# EAGLE design B7D_1_1 (EAGLE 8.3.2)
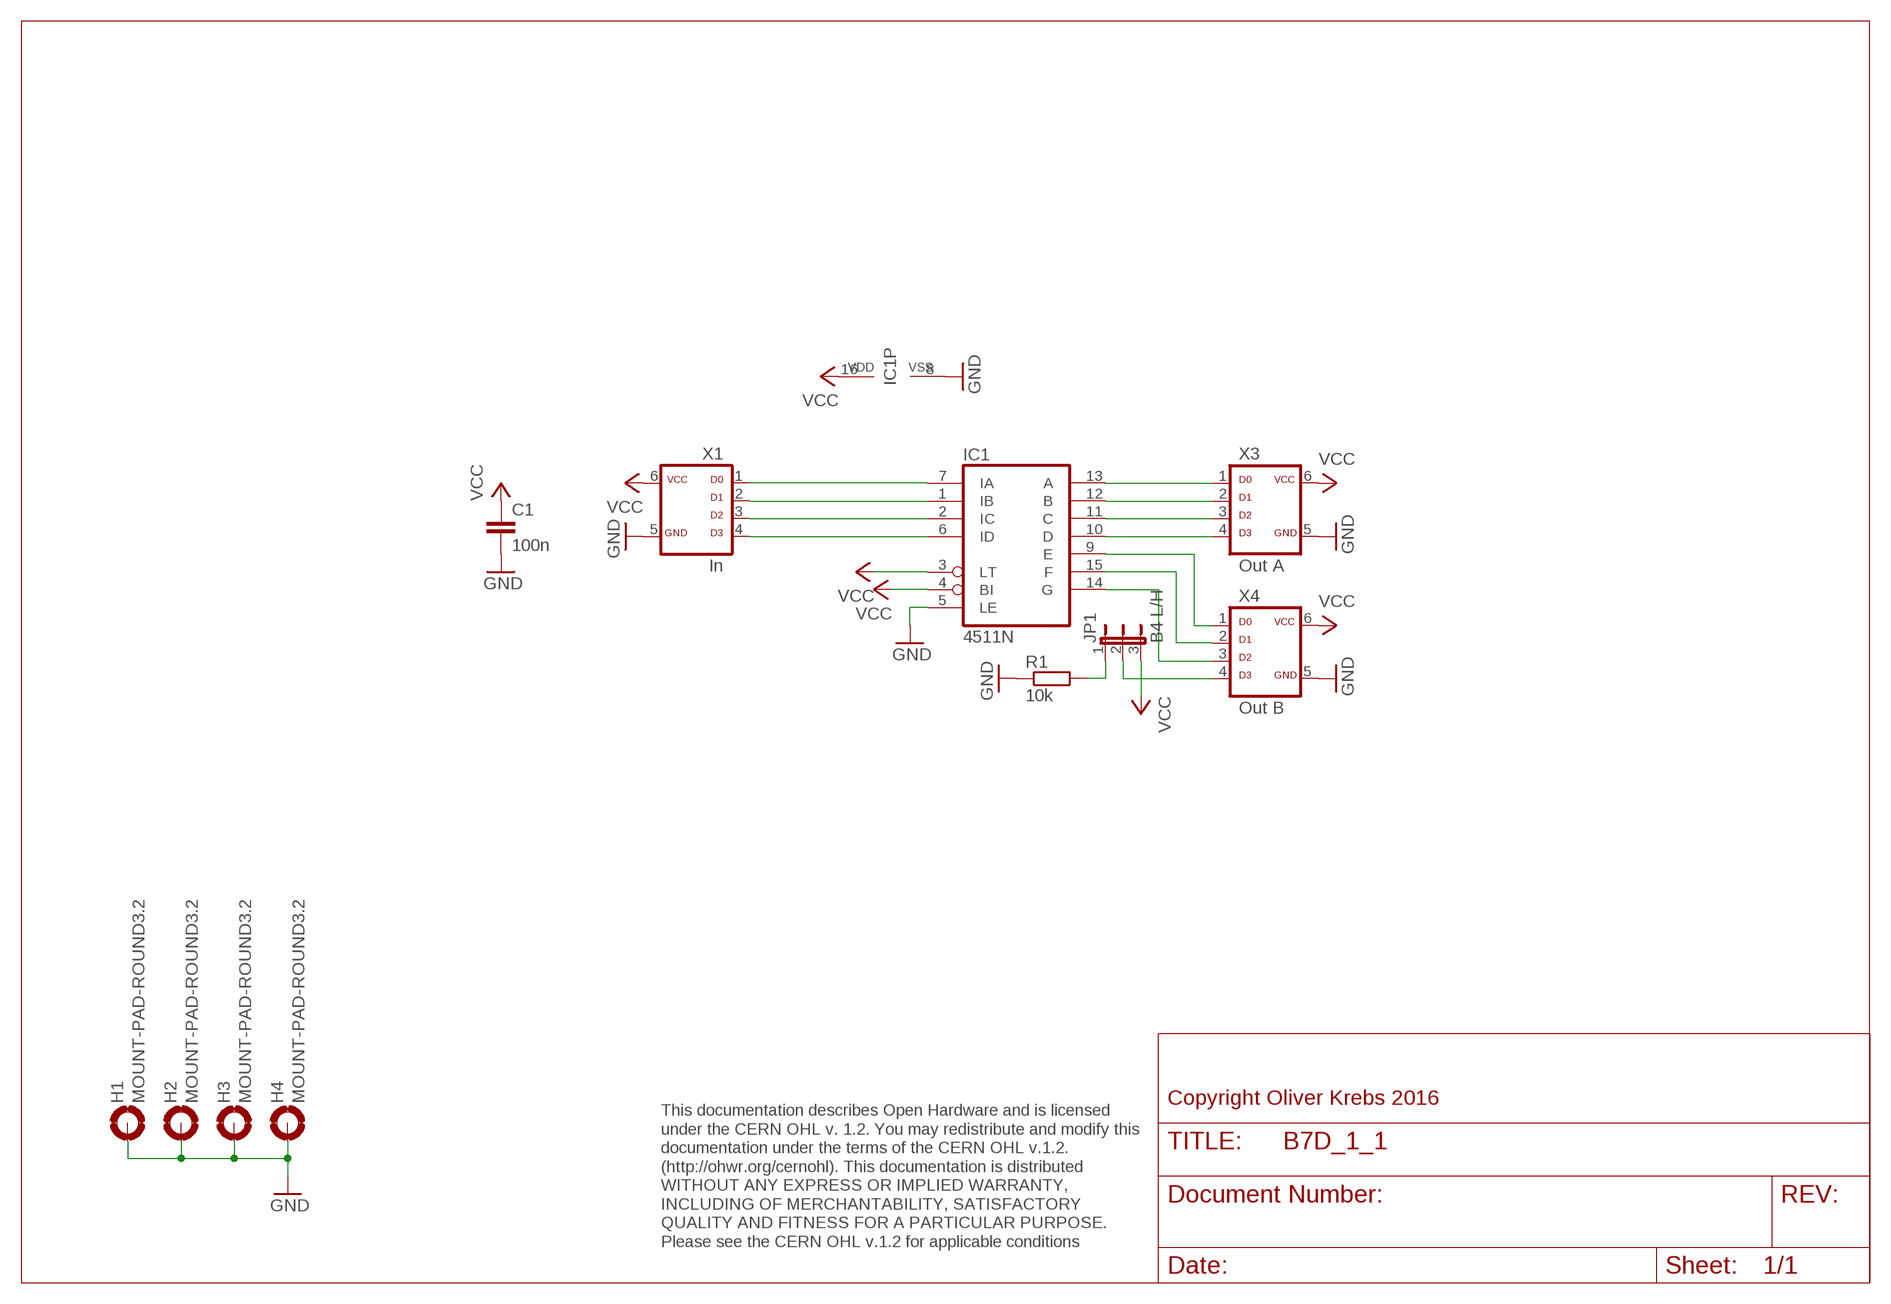
[diagram p0: schematic, sheet 1]

## Parts
C1  100n  C-EU050-025X075  [C050-025X075]
H1  MOUNT-PAD-ROUND3.2  [3,2-PAD]
H2  MOUNT-PAD-ROUND3.2  [3,2-PAD]
H3  MOUNT-PAD-ROUND3.2  [3,2-PAD]
H4  MOUNT-PAD-ROUND3.2  [3,2-PAD]
IC1  4511N  [DIL16]
JP1  B4 L/H  JP2E  [JP2]
R1  10k  R-EU_0207/10  [0207/10]
X1  In  ML6D  [ML-6]
X3  Out A  ML6D  [ML-6]
X4  Out B  ML6D  [ML-6]

## Nets
GND: C1.2 H1.B3,2(MOUNT) H2.B3,2(MOUNT) H3.B3,2(MOUNT) H4.B3,2(MOUNT) IC1.5(LE) IC1.8(VSS) R1.1 X1.5 X3.5 X4.5
N$1: IC1.7(IA) X1.1
N$2: IC1.1(IB) X1.2
N$3: IC1.2(IC) X1.3
N$4: IC1.6(ID) X1.4
N$5: IC1.13(A) X3.1
N$6: IC1.12(B) X3.2
N$7: IC1.11(C) X3.3
N$8: IC1.10(D) X3.4
N$9: IC1.9(E) X4.1
N$10: IC1.15(F) X4.2
N$11: IC1.14(G) X4.3
N$13: JP1.2 X4.4
N$14: JP1.1 R1.2
VCC: C1.1 IC1.3(LT) IC1.4(BI) IC1.16(VDD) JP1.3 X1.6 X3.6 X4.6

## Notes on the sheet
- Copyright Oliver Krebs 2016
- This documentation describes Open Hardware and is licensed 
  under the CERN OHL v. 1.2. You may redistribute and modify this 
  documentation under the terms of the CERN OHL v.1.2. 
  (http://ohwr.org/cernohl). This documentation is distributed
  WITHOUT ANY EXPRESS OR IMPLIED WARRANTY, 
  INCLUDING OF MERCHANTABILITY, SATISFACTORY 
  QUALITY AND FITNESS FOR A PARTICULAR PURPOSE. 
  Please see the CERN OHL v.1.2 for applicable conditions

## Library data of the parts
C1 = 01-my_rcl:C-EU: CAPACITOR, European symbol
H1-H4 = holes:MOUNT-PAD-ROUND: MOUNTING PAD, round
IC1 = 45xx:4511: BCD to 7-segment LATCH/DECODER/DRIVER
JP1 = jumper:JP2E: JUMPER
R1 = 01-my_rcl:R-EU_: RESISTOR, European symbol
X1 X3 X4 = 01-my-con:ML6D

## Board
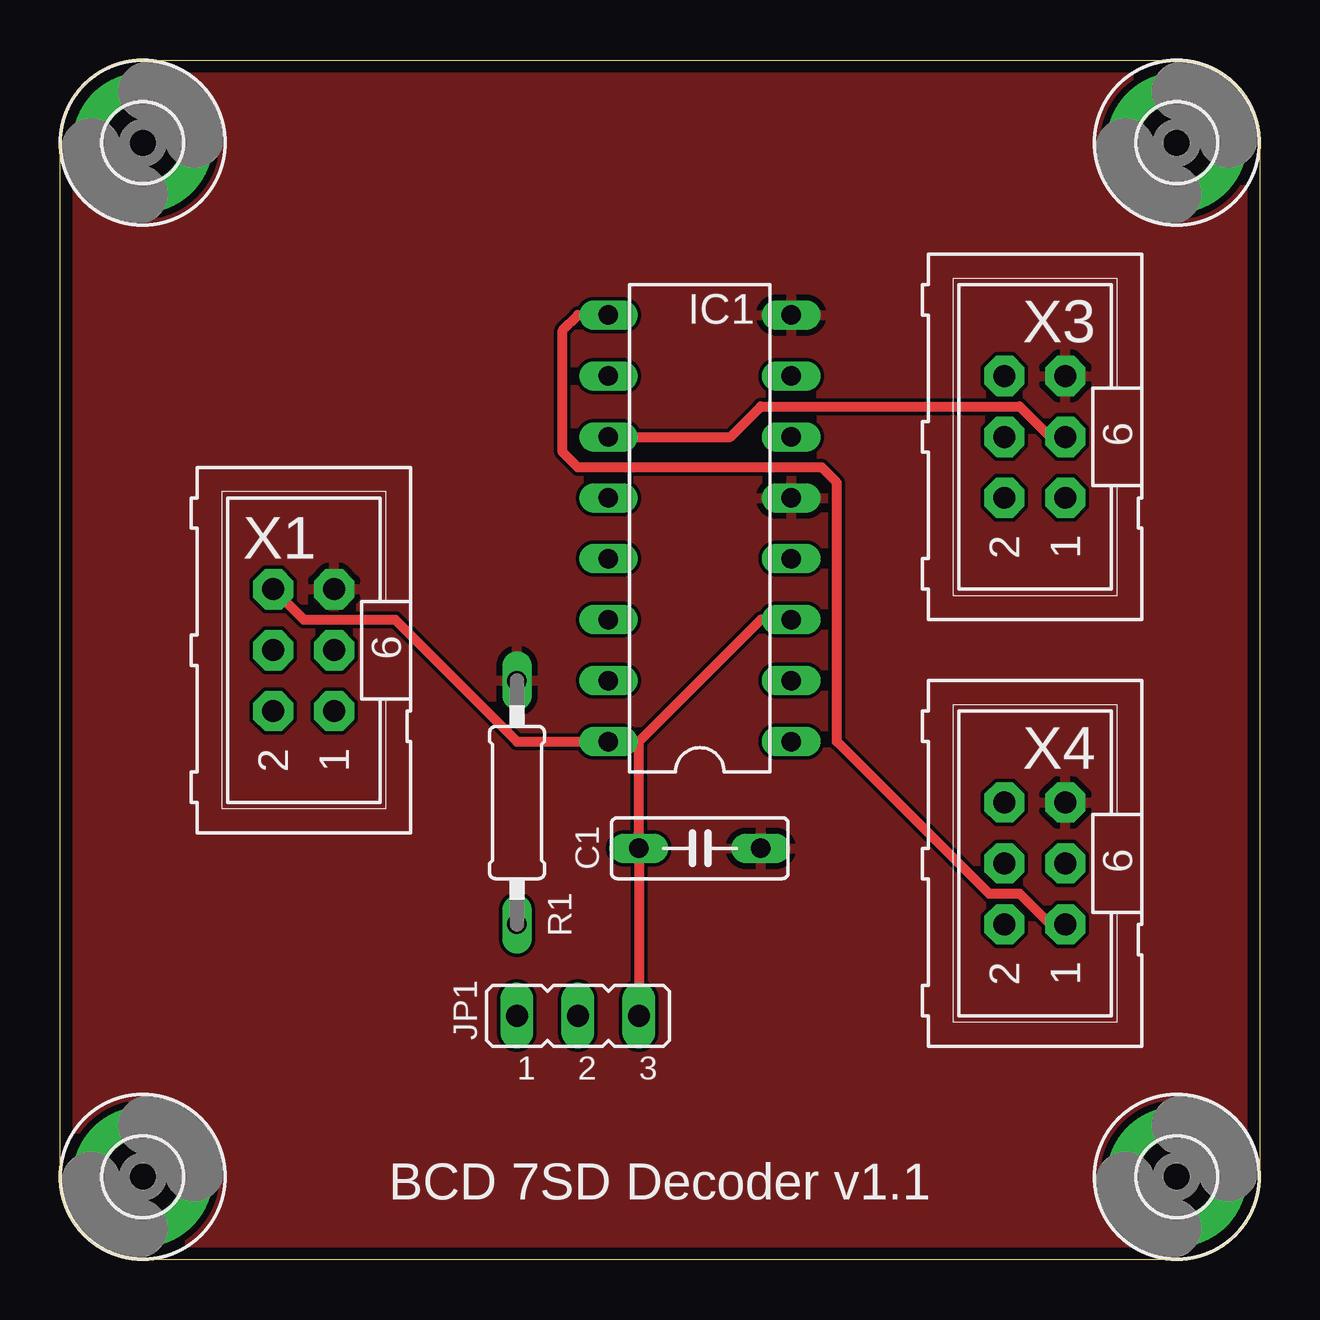
[diagram p1: board, top side]
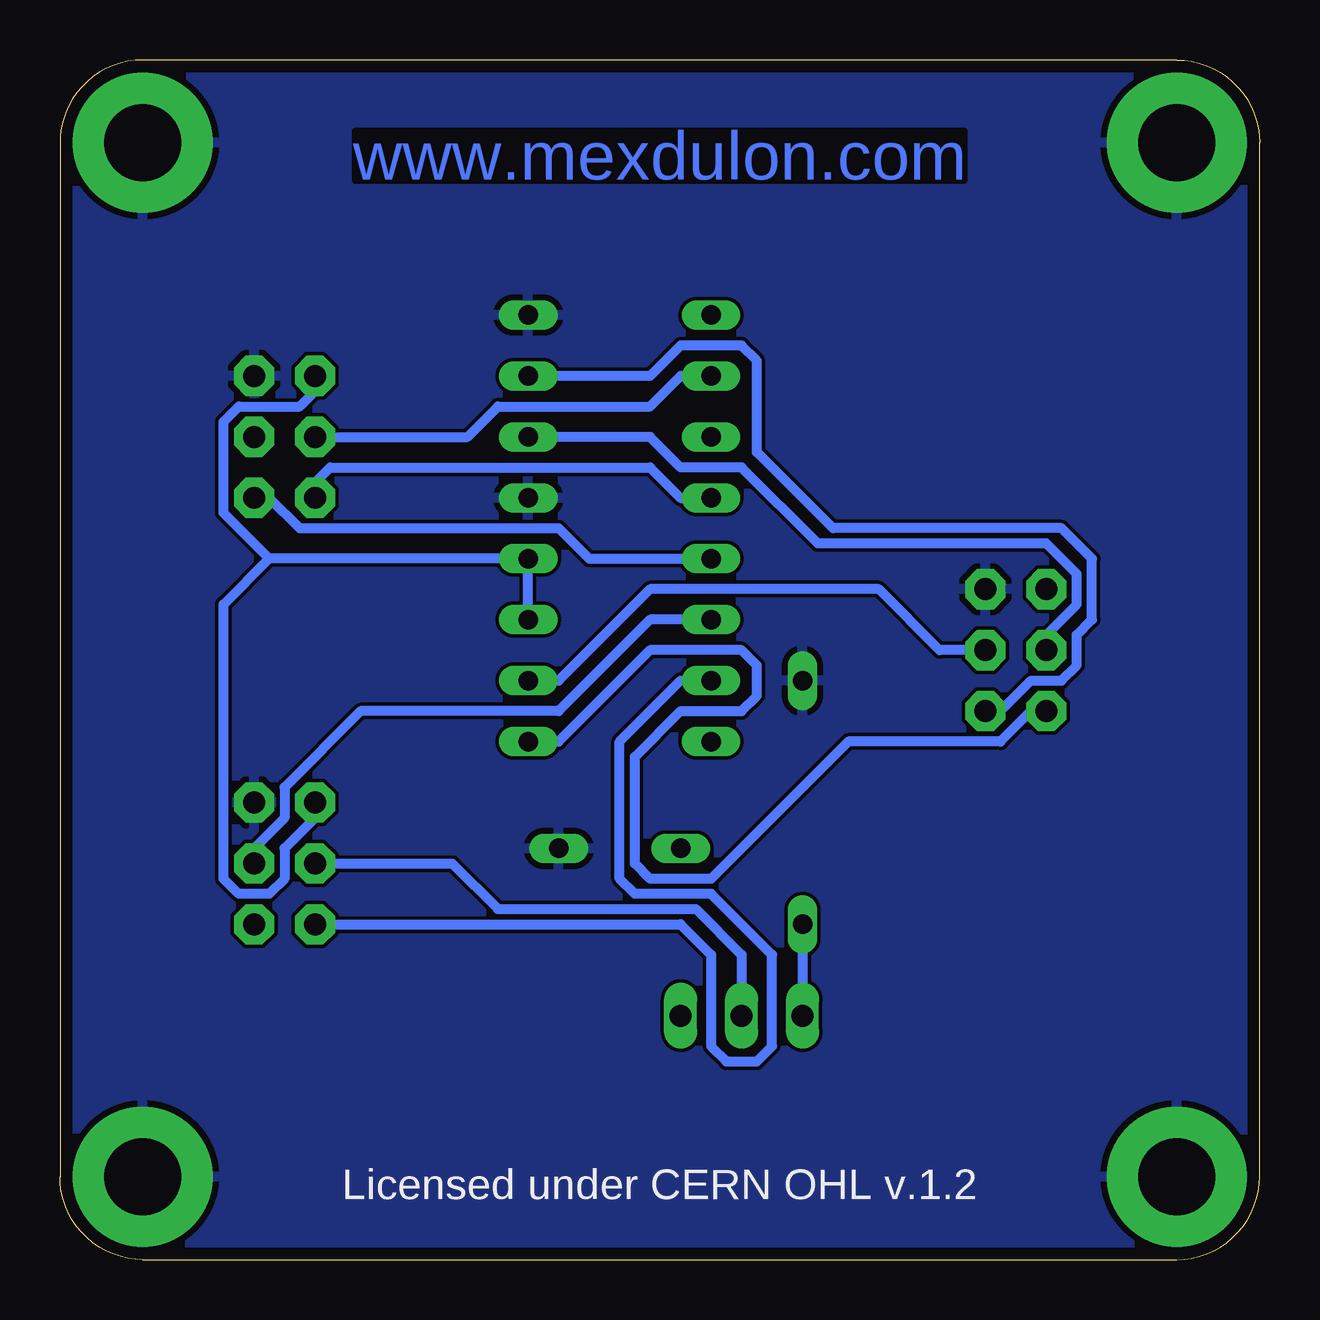
[diagram p2: board, bottom side, seen from below]

Size 50 x 50 mm. Coordinates in mm from the lower left corner, seen from the top.
Outline: 0,3.45 0,46.55 arc-90 3.45,50 46.55,50 arc-90 50,46.55 50,3.45 arc-90 46.55,0 3.45,0 arc-90 0,3.45
Copper layers (1*16): Top 0.035mm / dielectric 1.6mm / Bottom 0.035mm
Design rules "Elecrow_2-layer_PCB_eagle_rule": minimum track width 6mil, minimum drill 12mil, track to track 6mil, track to pad 6mil, pad to pad 6mil, via to via 8mil, smd to smd 0mil, copper to edge 20mil, drill to drill 10mil, minimum pad ring 6mil, minimum via ring 6mil, stop-mask expansion 0mil, vias tented up to drill 100mil, thermal gap 10mil

### Footprints (pad centres in the part's own frame; a part is rotated, then mirrored left to right if it is on the bottom)
C050-025X075 = drill 0.813 long: 1 -2.54,0; 2 2.54,0
3,2-PAD = drill 3.2 pad 5.842: B3,2 0,0
DIL16 = drill 0.813 long: 1 -8.89,-3.81; 2 -6.35,-3.81; 3 -3.81,-3.81; 4 -1.27,-3.81; 5 1.27,-3.81; 6 3.81,-3.81; 7 6.35,-3.81; 8 8.89,-3.81; 9 8.89,3.81; 10 6.35,3.81; 11 3.81,3.81; 12 1.27,3.81; 13 -1.27,3.81; 14 -3.81,3.81; 15 -6.35,3.81; 16 -8.89,3.81
JP2 = drill 0.914 long: 1 -2.54,0; 2 0,0; 3 2.54,0
0207/10 = drill 0.813 long: 1 -5.08,0; 2 5.08,0
ML-6 = drill 0.914 pad 1.676 octagon: 1 -2.54,-1.27; 2 -2.54,1.27; 3 0,-1.27; 4 0,1.27; 5 2.54,-1.27; 6 2.54,1.27

### Placement (x,y rotation side)
C1  26.67,17.14 0 top
H1  3.45,3.45 0 top
H2  3.45,46.55 0 top
H3  46.55,46.55 0 top
H4  46.55,3.45 0 top
IC1  26.67,30.48 90 top
JP1  21.59,10.16 0 top
R1  19.05,19.05 270 top
X1  10.16,25.4 90 top
X3  40.64,34.29 90 top
X4  40.64,16.51 90 top

### Tracks (layer width: path | path; a pad name or v marks a point on that pad's centre or on a via)
GND
  pour Bottom: 0,0 50.8,0 50.8,50.8 0,50.8
  pour Top: 0,50.16 50.16,50.16 50.16,0 0,0
N$1
  Bottom 0.406: X1.1 10.79,22.86 9.53,24.13 8.26,24.13 7.62,24.77 7.62,26.04 6.99,26.67 6.99,29.21 8.26,30.48 17.78,30.48 20.95,33.66 20.95,37.47 21.59,38.1 24.13,38.1 25.4,36.83 IC1.7
N$2
  Bottom 0.406: X1.2 9.53,22.86 10.79,21.59 17.14,21.59 22.86,15.88 25.4,15.88 26.04,16.51 26.04,20.95 24.13,22.86 21.59,22.86 20.95,23.5 20.95,24.77 21.59,25.4 25.4,25.4 29.21,21.59 IC1.1
N$3
  Bottom 0.406: X1.3 13.34,25.4 15.88,27.94 25.4,27.94 29.21,24.13 IC1.2
N$4
  Bottom 0.406: X1.4 8.89,26.04 7.62,27.3 7.62,28.57 8.89,29.84 18.41,29.84 21.59,33.02 24.13,33.02 25.4,34.29 IC1.6
N$5
  Bottom 0.406: X3.1 41.27,31.75 40.01,30.48 29.21,30.48 27.94,29.21 IC1.13
N$6
  Bottom 0.406: X3.2 39.37,32.38 38.73,33.02 25.4,33.02 24.13,31.75 IC1.12
N$7
  Top 0.406: IC1.11 27.94,34.29 29.21,35.56 40.01,35.56 41.27,34.29 X3.3
N$8
  Bottom 0.406: X3.4 33.02,34.29 31.75,35.56 25.4,35.56 24.13,36.83 IC1.10
N$9
  Top 0.406: X4.1 41.27,13.97 40.01,15.24 38.73,15.24 32.38,21.59 32.38,32.38 31.75,33.02 21.59,33.02 20.95,33.66 20.95,38.73 21.59,39.37 IC1.9
N$10
  Bottom 0.406: X4.2 24.13,13.97 22.86,12.7 22.86,8.89 22.23,8.26 20.95,8.26 20.32,8.89 20.32,12.7 22.86,15.24 26.04,15.24 26.67,15.88 26.67,21.59 24.13,24.13 IC1.15
N$11
  Bottom 0.406: IC1.14 25.4,26.67 29.21,22.86 37.47,22.86 40.64,19.68 40.64,18.41 41.91,17.14 X4.3
N$13
  Bottom 0.406: X4.4 33.66,16.51 31.75,14.61 23.5,14.61 21.59,12.7 JP1.2
N$14
  Bottom 0.406: R1.2 JP1.1
VCC
  Top 0.406: JP1.3 C1.1 24.13,21.59 | IC1.3 29.21,26.67 24.13,21.59 | 24.13,21.59 IC1.16 19.05,21.59 13.97,26.67 10.16,26.67 X1.6
  Bottom 0.406: IC1.3 IC1.4 41.27,29.21 | 41.27,29.21 43.18,31.11 43.18,34.92 42.55,35.56 40.01,35.56 39.37,36.2 X3.6 | X4.6 39.37,18.41 40.64,17.14 40.64,15.88 41.27,15.24 42.55,15.24 43.18,15.88 43.18,27.3 41.27,29.21

### Text on the board
Bottom: www.mexdulon.com
tNames: BCD 7SD Decoder v1.1
bNames: Licensed under CERN OHL v.1.2